# EAGLE design Vattenkran (EAGLE 8.7.1)
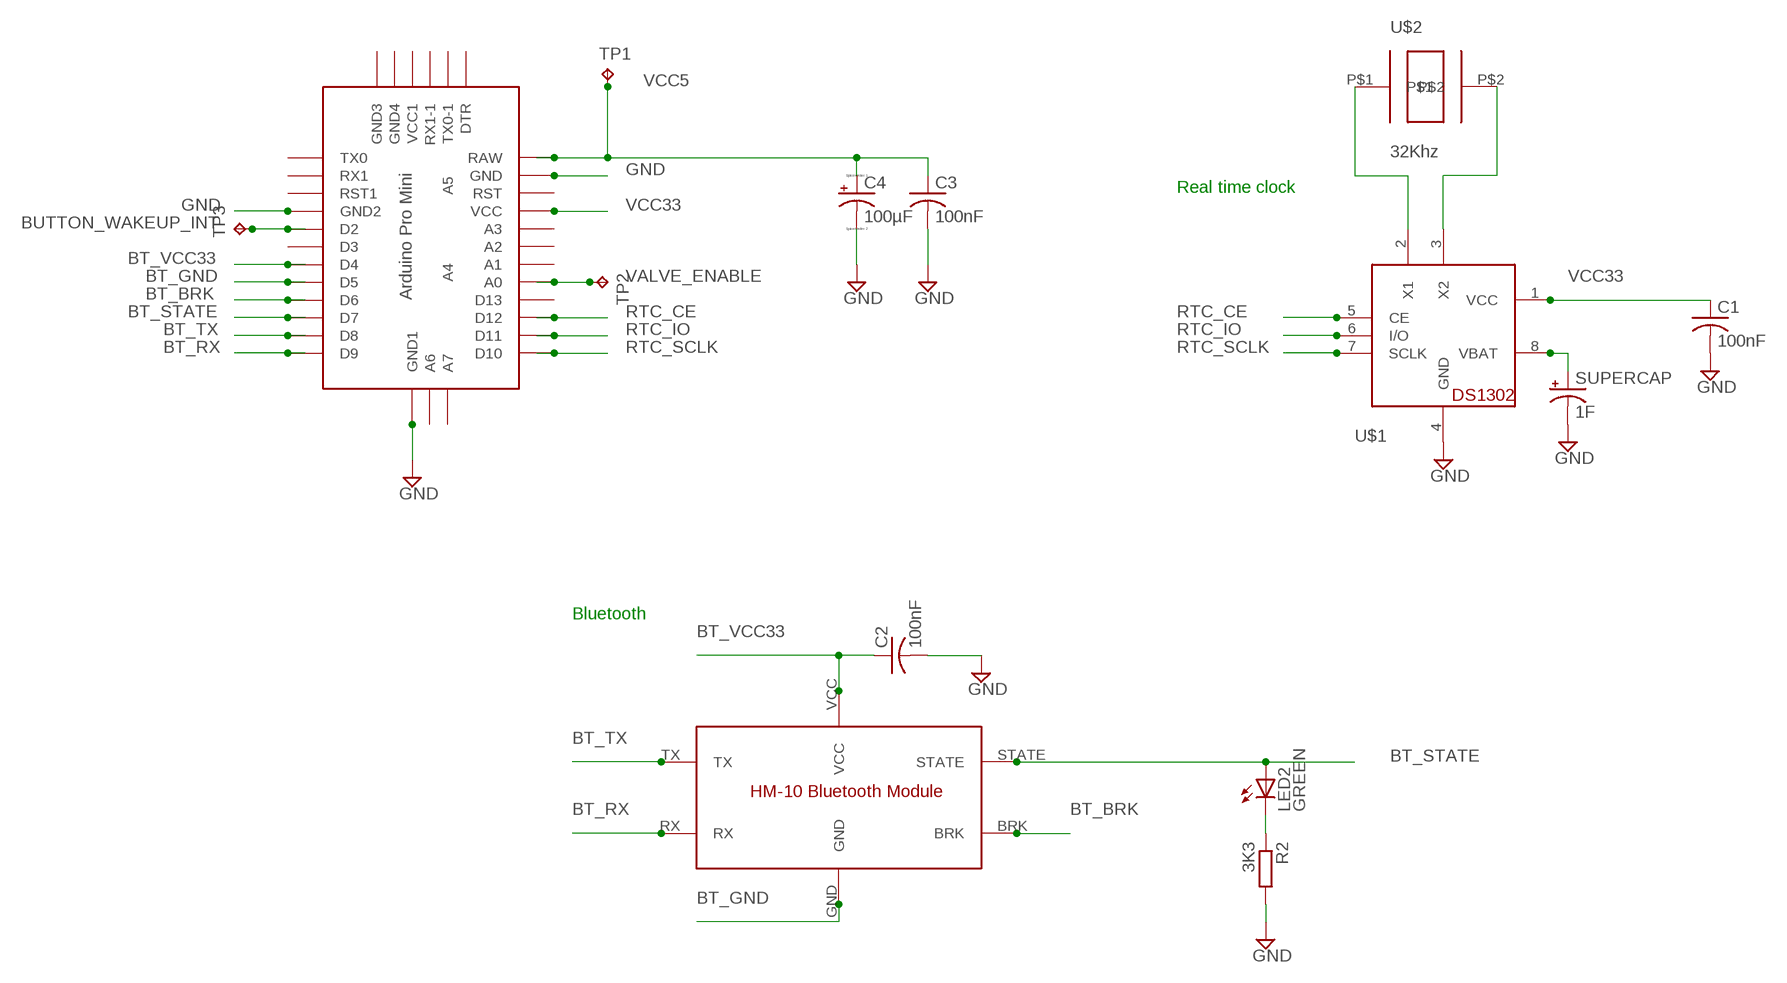
[diagram p0: schematic, sheet 1]

## Parts
C1  100nF  C-USC0805  [C0805]
C2  100nF  C-USC0805  [C0805]
C3  100nF  C-USC0805  [C0805]
C4  100µF  CPOL-USD  [PANASONIC_D]
LED2  GREEN  LED3MM  [LED3MM]
R2  3K3  R-EU_R0805  [R0805]
SUPERCAP  1F  CPOL-USETR2  [ETR2]
TP1  TPB1,27  [B1,27]
TP2  TPB1,27  [B1,27]
TP3  TPB1,27  [B1,27]
U$1  DS1302  [SOP8]
U$2  32Khz  CLOCK_CRYSTAL_32KHZ  [SM3]
U$4  HM10_BLUETOOTH_MODULE  [HM10_BLUETOOTH_MODULE]
U$7  ABK-PRO-MINI  [ABK-PRO-MINI]

## Nets
BT_BRK: U$4.BRK U$7.D6
BT_GND: U$4.GND U$7.D5
BT_RX: U$4.RX U$7.D9
BT_STATE: LED2.A U$4.STATE U$7.D7
BT_TX: U$4.TX U$7.D8
BT_VCC33: C2.1 U$4.VCC U$7.D4
BUTTON_WAKEUP_INT: TP3.TP U$7.D2
GND: C1.2 C2.2 C3.2 C4.- R2.2 SUPERCAP.- U$1.4(GND) U$7.GND U$7.GND1(GND2) U$7.GND4(GND1)
N$3: LED2.K(C) R2.1
N$4: U$1.2(X1) U$2.P$1
N$5: U$1.3(X2) U$2.P$2
RTC_CE: U$1.5(CE) U$7.D12
RTC_IO: U$1.6(I/O) U$7.D11
RTC_SCLK: U$1.7(SCLK) U$7.D10
SUPERCAP: SUPERCAP.+ U$1.8(VBAT)
VALVE_ENABLE: TP2.TP U$7.A0
VCC5: C3.1 C4.+ TP1.TP U$7.RAW
VCC33: C1.1 U$1.1(VCC) U$7.VCC
Unconnected: U$7.A1 U$7.A2 U$7.A3 U$7.A4 U$7.A5 U$7.A6 U$7.A7 U$7.D3 U$7.D13 U$7.DTR U$7.GND2(GND3) U$7.GND3(GND4) U$7.RST U$7.RST1 U$7.RX1 U$7.RX1-1 U$7.TX0 U$7.TX0-1 U$7.VCC1

## Notes on the sheet
- Real time clock
- Bluetooth

## Library data of the parts
C1-C3 = resistor:C-US: CAPACITOR, American symbol
C4 = resistor:CPOL-US: POLARIZED CAPACITOR, American symbol
LED2 = led:LED: LED OSRAM: - CHIPLED LG R971, LG N971, LY N971, LG Q971, LY Q971, LO R971, LY R971 LH N974, LH R974 LS Q976, LO Q976, LY Q976 LO Q996 - Hyper CHIPLED LW Q18S LB Q993, LB Q99A, LB R99A - SideLED LS A670, LO A670, LY A670, LG A670, LP A670 LB A673, LV A673, LT A673, LW A673 LH A674 LY A675 LS A676, LA A676, LO A676, LY A676, LW A676 LS A679, LY A679, LG A679 - Hyper Micro SIDELED® LS Y876, LA Y876, LO Y876, LY Y876 LT Y87S - SmartLED LW L88C, LW L88S LB L89C, LB L89S, LG L890 LS L89K, LO L89K, LY L89K LS L896, LA L896, LO L896, LY L896 - TOPLED LS T670, LO T670, LY T670, LG T670, LP T670 LSG T670, LSP T670, LSY T670, LOP T670, LYG T670 LG T671, LOG T671, LSG T671 LB T673, LV T673, LT T673, LW T673 LH T674 LS T676, LA T676, LO T676, LY T676, LB T676, LH T676, LSB T676, LW T676 LB T67C, LV T67C, LT T67C, LS T67K, LO T67K, LY T67K, LW E67C LS E67B, LA E67B, LO E67B, LY E67B, LB E67C, LV E67C, LT E67C LW T67C LS T679, LY T679, LG T679 LS T770, LO T770, LY T770, LG T770, LP T770 LB T773, LV T773, LT T773, LW T773 LH T774 LS E675, LA E675, LY E675, LS T675 LS T776, LA T776, LO T776, LY T776, LB T776 LHGB T686 LT T68C, LB T68C - Hyper Mini TOPLED® LB M676 - Mini TOPLED Santana® LG M470 LS M47K, LO M47K, LY M47K Source: http://www.osram.convergy.de LUXEON: - LUMILED® LXK2-PW12-R00, LXK2-PW12-S00, LXK2-PW14-U00, LXK2-PW14-V00 LXK2-PM12-R00, LXK2-PM12-S00, LXK2-PM14-U00 LXK2-PE12-Q00, LXK2-PE12-R00, LXK2-PE12-S00, LXK2-PE14-T00, LXK2-PE14-U00 LXK2-PB12-K00, LXK2-PB12-L00, LXK2-PB12-M00, LXK2-PB14-N00, LXK2-PB14-P00, LXK2-PB14-Q00 LXK2-PR12-L00, LXK2-PR12-M00, LXK2-PR14-Q00, LXK2-PR14-R00 LXK2-PD12-Q00, LXK2-PD12-R00, LXK2-PD12-S00 LXK2-PH12-R00, LXK2-PH12-S00 LXK2-PL12-P00, LXK2-PL12-Q00, LXK2-PL12-R00 Source: www.luxeon.com KINGBRIGHT: KA-3528ASYC Source: www.kingbright.com
R2 = resistor:R-EU_: RESISTOR, European symbol
SUPERCAP = rcl:CPOL-US: POLARIZED CAPACITOR, American symbol; SPICEPREFIX: C
TP1-TP3 = testpad:TP: Test pad
U$1 = adafruit:DS1302: DS1302 - Real time clock with supercap trickle charger
U$2 = Semiconductors:CLOCK_CRYSTAL_32KHZ: 32.768 KHz clock crystal
U$4 = breakout-modules:HM10_BLUETOOTH_MODULE: HM-10 Bluetooth 4 BLE Modules Breaks out the pins VCC GND RX/TX STATE BRK http://www.martyncurrey.com/hm-10-bluetooth-4ble-modules/
U$7 = Arduino-clone:ABK-PRO-MINI: ABK Pro-Mini Arduino Clone

## Board
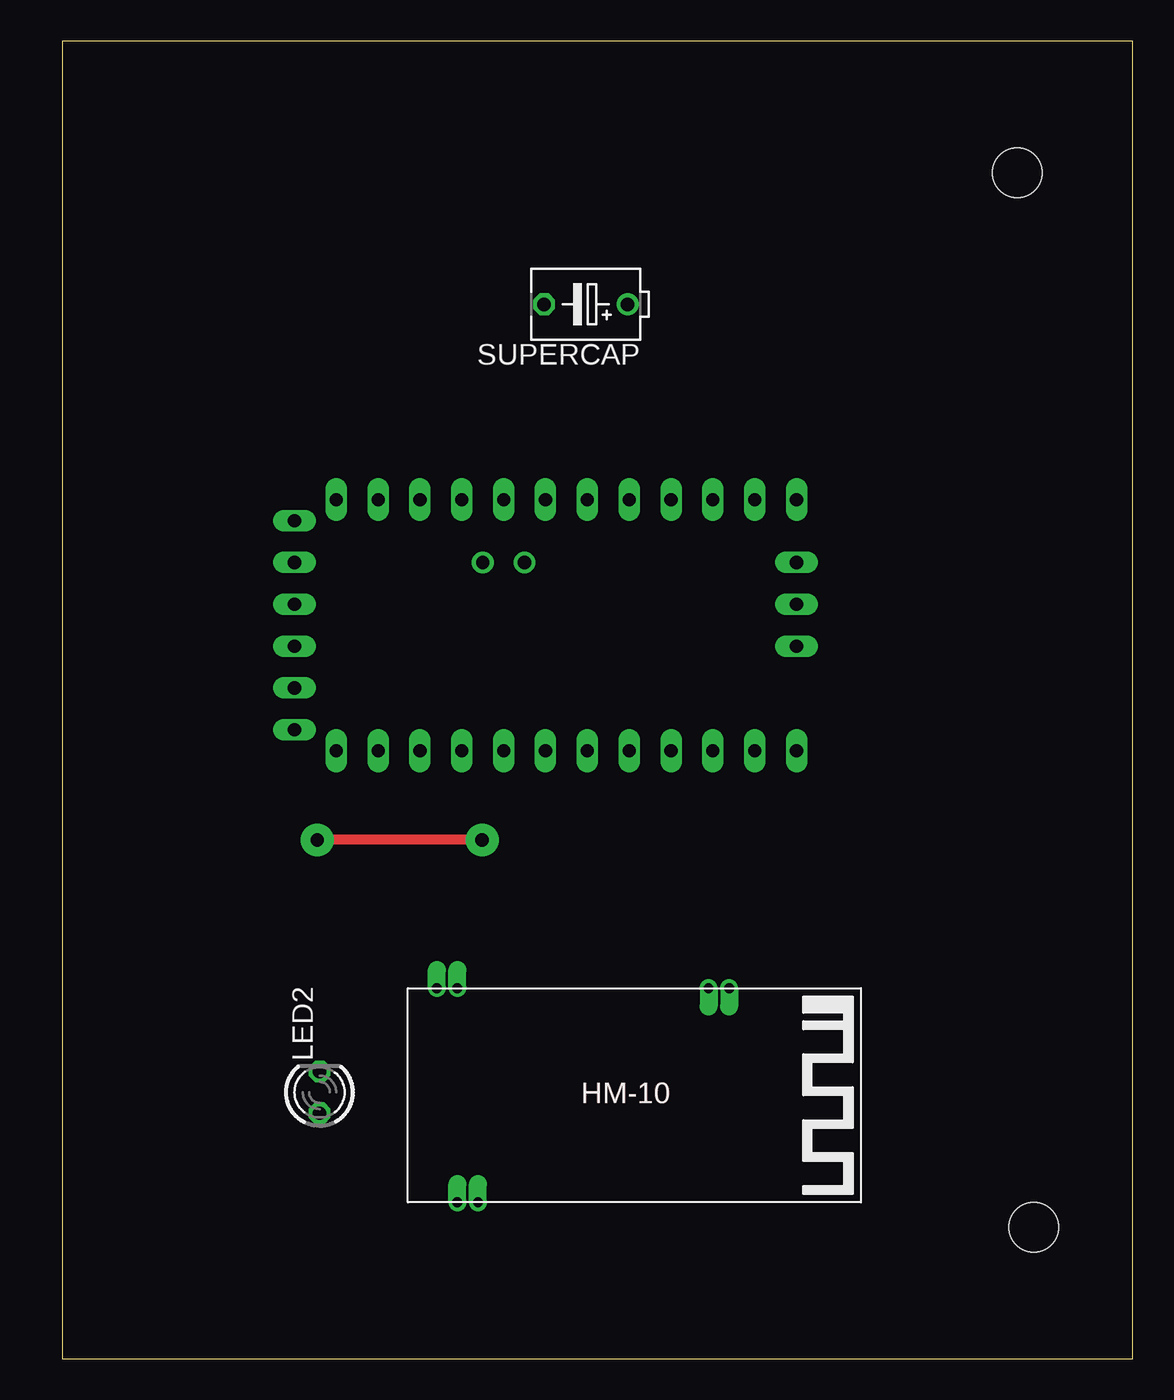
[diagram p1: board, top side]
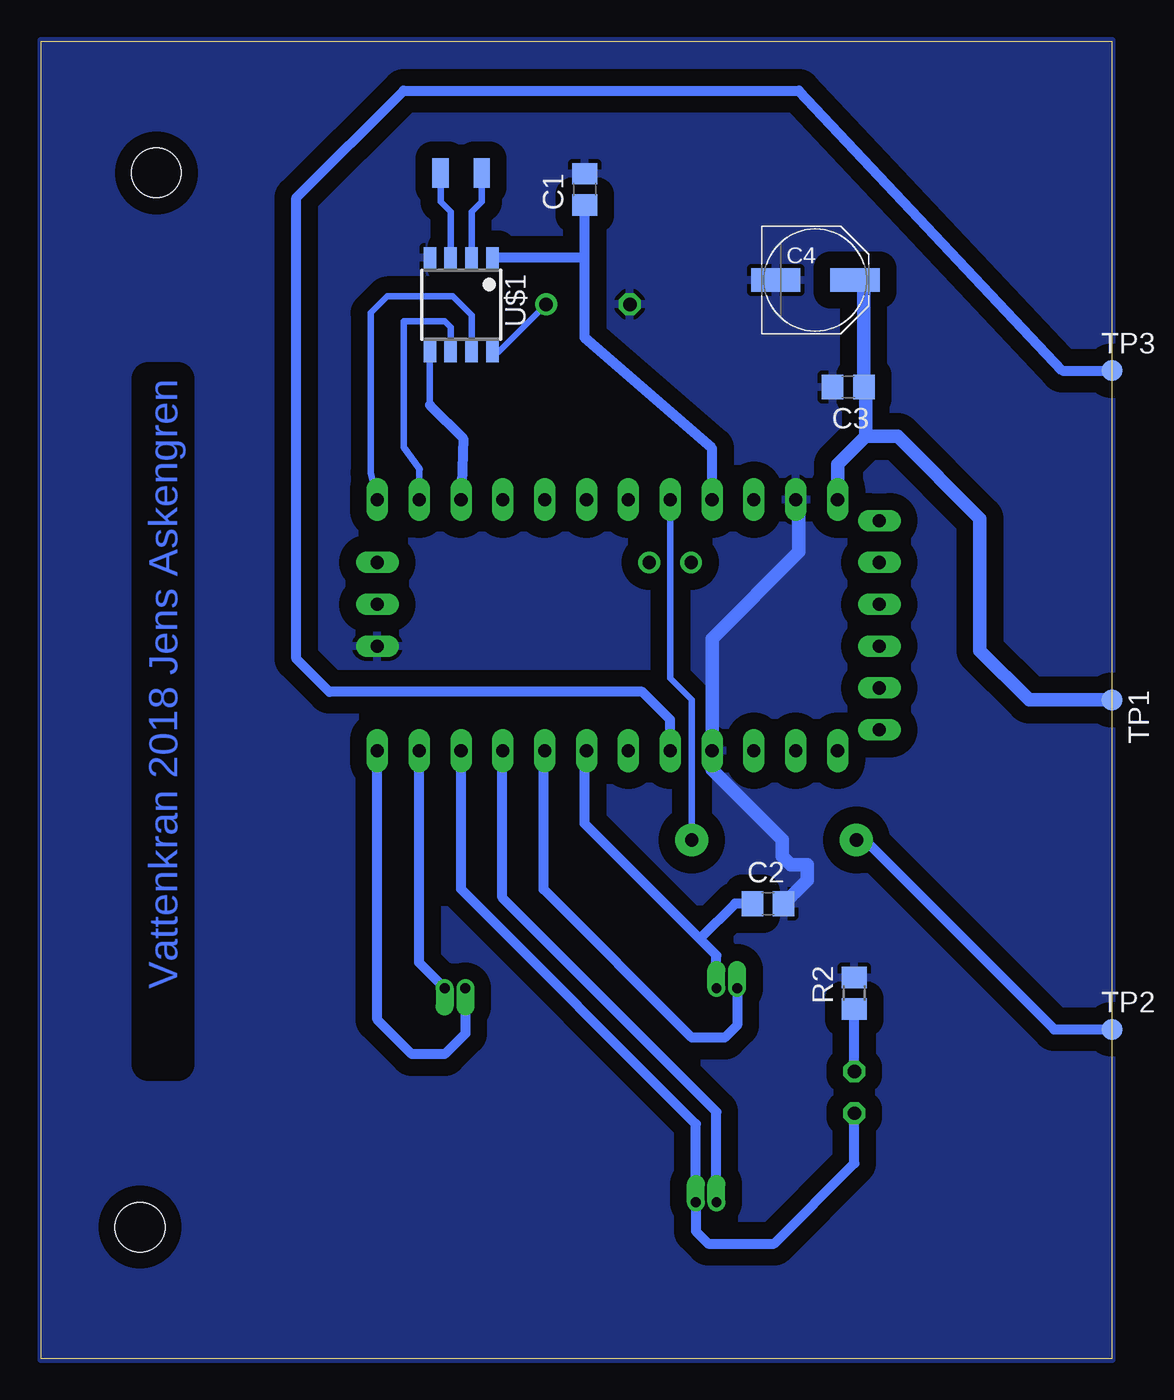
[diagram p2: board, bottom side, seen from below]

Size 65 x 80 mm. Coordinates in mm from the lower left corner, seen from the top.
Outline: 0,0 65,0 65,80 0,80 0,0
Copper layers (1*16): Top 0.035mm / dielectric 1.5mm / Bottom 0.035mm
Design rules "default *": minimum track width 6mil, minimum drill 0.35mm, track to track 6mil, track to pad 6mil, pad to pad 6mil, via to via 6mil, smd to smd 6mil, copper to edge 0mil, drill to drill 6mil, minimum pad ring 10mil, minimum via ring 8mil, stop-mask expansion 4mil, vias tented up to drill 0mil, thermal gap 10mil
Holes 3 mm at 58,72 59,8

### Footprints (pad centres in the part's own frame; a part is rotated, then mirrored left to right if it is on the bottom)
C0805 = smd 1.3 x 1.5: 1 -0.95,0; 2 0.95,0
PANASONIC_D = smd 3 x 1.4: + 2.4,0; - -2.4,0
LED3MM = drill 0.813 octagon: A -1.27,0; K 1.27,0
R0805 = smd 1.3 x 1.5: 1 -0.95,0; 2 0.95,0
ETR2 = drill 0.813: + -2.54,0 | drill 0.813 octagon: - 2.54,0
B1,27 = smd 1.27 x 1.27: TP 0,0
SOP8 = smd 0.76 x 1.27: 1 -1.905,-2.86; 2 -0.635,-2.86; 3 0.635,-2.86; 4 1.905,-2.86; 5 1.905,2.86; 6 0.635,2.86; 7 -0.635,2.86; 8 -1.905,2.86
SM3 = smd 1.8 x 1: P$1 0,1.25; P$2 0,-1.25
HM10_BLUETOOTH_MODULE = drill 0.6 pad 0.85 offset: BRK 6.5,3; GND -6.5,1.75; RX -6.5,18.25; STATE 6.5,4.25; TX -6.5,19.5; VCC -6.5,3
ABK-PRO-MINI = drill 0.8 long: A0 10.16,-3.81; A1 10.16,-6.35; A2 10.16,-8.89; A3 10.16,-11.43; A6 3.81,-21.59; A7 6.35,-21.59; D2 -5.08,-3.81; D3 -5.08,-6.35; D4 -5.08,-8.89; D5 -5.08,-11.43; D6 -5.08,-13.97; D7 -5.08,-16.51; D8 -5.08,-19.05; D9 -5.08,-21.59; D10 10.16,-21.59; D11 10.16,-19.05; D12 10.16,-16.51; D13 10.16,-13.97; DTR 8.89,8.89; GND 10.16,3.81; GND1 -5.08,-1.27; GND2 -3.81,8.89; GND3 -1.27,8.89; GND4 1.27,-21.59; RAW 10.16,6.35; RST 10.16,1.27; RST1 -5.08,1.27; RX1 -5.08,3.81; RX1-1 3.81,8.89; TX0 -5.08,6.35; TX0-1 6.35,8.89; VCC 10.16,-1.27; VCC1 1.27,8.89 | drill 0.8: A4 6.35,-5.08; A5 6.35,-2.54

### Placement (x,y rotation side)
C1  32,71 90 bottom
C2  20.87,27.63 0 bottom
C3  16,59 180 bottom
C4  18,65.5 0 bottom
LED2  15.63,16.18 90 top
R2  15.63,22.2 90 bottom
SUPERCAP  31.8,64.02 180 top
TP1  0,40 270 bottom
TP2  0,20 0 bottom
TP3  0,60 0 bottom
U$1  39.5,64 180 bottom
U$2  39.5,72 270 bottom
U$4  21,16 270 top
U$7  23,42 90 top

### Tracks (layer width: path | path; a pad name or v marks a point on that pad's centre or on a via)
BT_BRK
  Bottom 0.61: U$4.BRK 24,15 37,28 37,36.89 U$7.D6
BT_GND
  Bottom 0.61: U$4.GND 22.75,20.25 23.5,19.5 25.5,19.5 34.5,28.5 34.5,36.85 U$7.D5
BT_RX
  Bottom 0.61: U$4.RX 39.25,19.75 40.5,18.5 42.5,18.5 44.59,20.59 U$7.D9
BT_STATE
  Bottom 0.61: U$7.D7 39.51,28.51 25.25,14.25 U$4.STATE 25.25,7.75 24.5,7 20.5,7 15.63,11.87 LED2.A
BT_TX
  Bottom 0.61: U$4.TX 42.05,24.05 U$7.D8
BT_VCC33
  Bottom 0.61: U$4.VCC 24,24.5 25,25.5 | 25,25.5 32,32.5 32,36.81 U$7.D4 | C2.1 22.87,27.63 25,25.5
BUTTON_WAKEUP_INT
  Bottom 0.61: U$7.D2 26.81,38.81 28.5,40.5 47.5,40.5 49.5,42.5 49.5,70.5 43,77 19,77 3,60 TP3.TP
GND
  Bottom 0.813: U$7.GND 19,51.97 19,49 24.27,43.73 U$7.GND1 24.27,35.77 20,31.5 20,30.5 19.5,30 18.5,30 18.5,29.05 C2.2
  pour Bottom (isolate 1.016): 0,80 65,80 65,0 0,0
N$3
  Bottom 0.61: LED2.K R2.1
N$4
  Bottom 0.406: U$1.2 38.87,69.64 38.25,70.25 U$2.P$1
N$5
  Bottom 0.406: U$1.3 40.13,69.64 40.75,70.25 U$2.P$2
RTC_CE
  Bottom 0.406: U$1.5 41.41,57.91
  Bottom 0.61: U$7.D12 39.38,55.88 41.41,57.91
RTC_IO
  Bottom 0.406: U$1.6 40.13,62.63 40.5,63 43,63 43,55.34 42,54 42.05,53.95 U$7.D11
RTC_SCLK
  Bottom 0.406: U$1.7 38.87,63.37 40,64.5 44,64.5 45,63.5 45,53.8 U$7.D10
SUPERCAP
  Bottom 0.406: SUPERCAP.+ 37.22,61.14 U$1.8
VALVE_ENABLE  (via drill 0.8 pad 2)
  Top 0.61: v25.5,31.5 v15.5,31.5
  Bottom 0.406: U$7.A0 26.81,41.31 25.5,40 v25.5,31.5
  Bottom 0.61: v15.5,31.5 15,31.5 3.5,20 -0.18,20 0,19.68 TP2.TP
VCC5
  Bottom 0.813: 16.5,52.31 U$7.RAW 16.65,54.3 14.95,56 | 14.95,56 13,56 8,51 8,43 5,40 TP1.TP | 14.95,56 14.95,58.9 C3.1 15.05,64.95 C4.+
VCC33
  Bottom 0.61: U$7.VCC 24.27,55.27 32,62 32,67 | U$1.1 32.14,66.86 32,67 | 32,67 C1.1

### Text on the board
Bottom: Vattenkran 2018 Jens Askengren